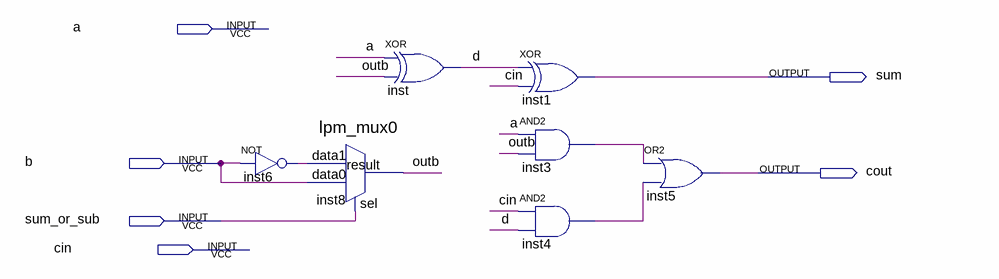
[diagram p0: schematic sheet]
// Quartus schematic Adder_1bit.bdf as structural Verilog: 7 symbols, 6 pins
module Adder_1bit (
  input  a,
  input  b,
  input  sum_or_sub,
  input  cin,
  output sum,
  output cout
);

  wire d, inst3_out, inst4_out, inst6_out, outb;

  not inst6 (inst6_out, b);
  lpm_mux0 inst8 (.data1(inst6_out), .data0(b), .sel(sum_or_sub), .result(outb));
  xor inst (d, a, outb);
  xor inst1 (sum, d, cin);
  and inst3 (inst3_out, a, outb);
  and inst4 (inst4_out, cin, d);
  or inst5 (cout, inst3_out, inst4_out);
endmodule
